# Altium schematic sheet SensWear_DaughterBoard.SchDoc
size A4; SheetNumber: 8; SheetTotal: 8
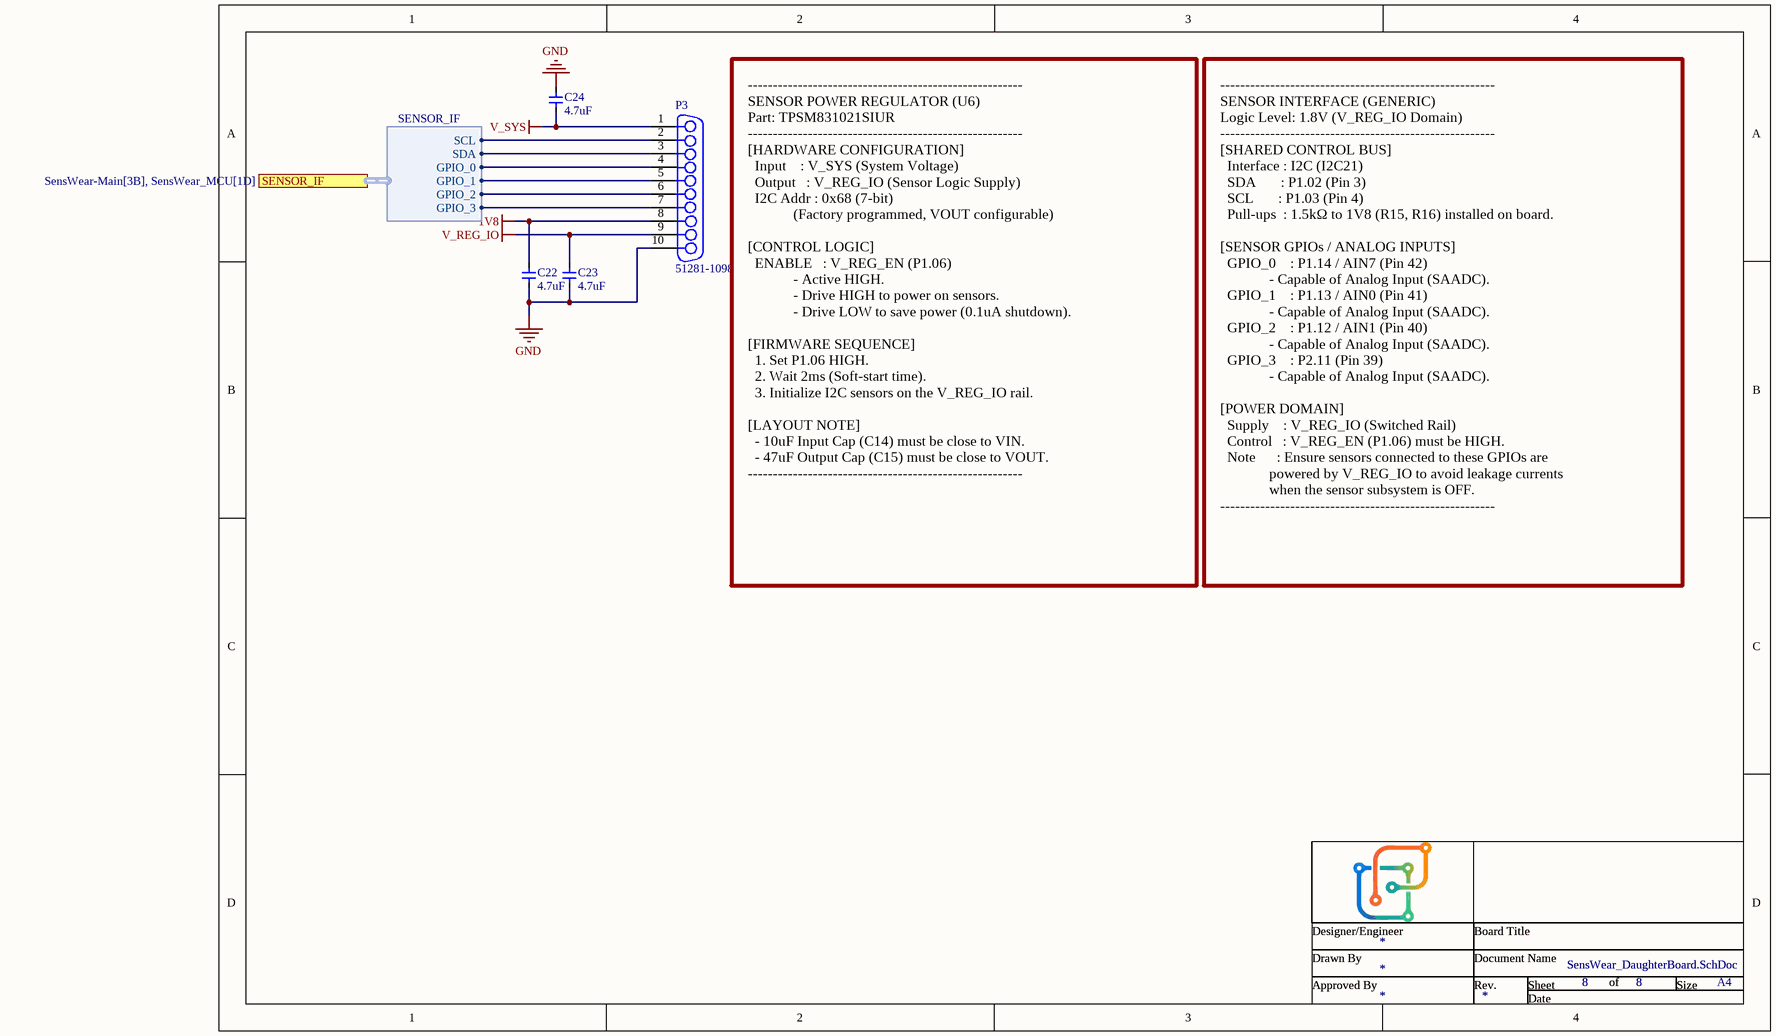
[diagram p0: SensWear_DaughterBoard.SchDoc]

## Parts
C22  4.7uF  [CAPC1005X05N]
C23  4.7uF  [CAPC1005X05N]
C24  4.7uF  [CAPC1005X05N]
P3  51281-1098  [51281-1098__3]

## Ports
SENSOR_IF (harness SENSOR_IF, see SensWear-Main[3B], SensWear_MCU[1D])

## Harnesses
SENSOR_IF: SCL, SDA, GPIO_0, GPIO_1, GPIO_2, GPIO_3

## Nets
1V8: C22.2 P3.8
GND: C22.1 C23.1 C24.2 P3.10
V_REG_IO: C23.2 P3.9
V_SYS: C24.1 P3.1
NetP3_2: P3.2 ; port SENSOR_IF.SCL
NetP3_3: P3.3 ; port SENSOR_IF.SDA
NetP3_4: P3.4 ; port SENSOR_IF.GPIO_0
NetP3_5: P3.5 ; port SENSOR_IF.GPIO_1
NetP3_6: P3.6 ; port SENSOR_IF.GPIO_2
NetP3_7: P3.7 ; port SENSOR_IF.GPIO_3

## Notes on the sheet
- -------------------------------------------------------
  SENSOR POWER REGULATOR (U6)
  Part: TPSM831021SIUR
  -------------------------------------------------------
  [HARDWARE CONFIGURATION]
  Input    : V_SYS (System Voltage)
  Output   : V_REG_IO (Sensor Logic Supply)
  I2C Addr : 0x68 (7-bit)
  (Factory programmed, VOUT configurable)
  [CONTROL LOGIC]
  ENABLE   : V_REG_EN (P1.06)
  - Active HIGH.
  - Drive HIGH to power on sensors.
  - Drive LOW to save power (0.1uA shutdown).
  [FIRMWARE SEQUENCE]
  1. Set P1.06 HIGH.
  2. Wait 2ms (Soft-start time).
  3. Initialize I2C sensors on the V_REG_IO rail.
  [LAYOUT NOTE]
  - 10uF Input Cap (C14) must be close to VIN.
  - 47uF Output Cap (C15) must be close to VOUT.
  -------------------------------------------------------
- -------------------------------------------------------
  SENSOR INTERFACE (GENERIC)
  Logic Level: 1.8V (V_REG_IO Domain)
  -------------------------------------------------------
  [SHARED CONTROL BUS]
  Interface : I2C (I2C21)
  SDA       : P1.02 (Pin 3)
  SCL       : P1.03 (Pin 4)
  Pull-ups  : 1.5kΩ to 1V8 (R15, R16) installed on board.
  [SENSOR GPIOs / ANALOG INPUTS]
  GPIO_0    : P1.14 / AIN7 (Pin 42)
  - Capable of Analog Input (SAADC).
  GPIO_1    : P1.13 / AIN0 (Pin 41)
  - Capable of Analog Input (SAADC).
  GPIO_2    : P1.12 / AIN1 (Pin 40)
  - Capable of Analog Input (SAADC).
  GPIO_3    : P2.11 (Pin 39)
  - Capable of Analog Input (SAADC).
  [POWER DOMAIN]
  Supply    : V_REG_IO (Switched Rail)
  Control   : V_REG_EN (P1.06) must be HIGH.
  Note      : Ensure sensors connected to these GPIOs are
  powered by V_REG_IO to avoid leakage currents
  when the sensor subsystem is OFF.
  -------------------------------------------------------
- Designer/Engineer
- Drawn By
- Document Name
- Board Title
- Sheet
- of
- Size
- A4
- Approved By
- Rev.
- Date

## Library data of the parts
C22-C24 = GRM155R61A475MEAAD: Multilayer Ceramic Capacitor, 4.7 uF, 10 V, ± 20%, X5R, 0402 [1005 Metric]; Manufacturer: Murata; Material: 4241ConductorMaterial; Voltage Rating: 10V; Dielectric: 1537DielectricType; Manufacturer Part Number: GRM155R61A475MEAAD; RoHS: Yes; Category: Ceramic Capacitors; Stock: 930000; Pricing: 10000=0,0187, 50000=0,0159, 100000=0,0132 (USD); Mounting Technology: Surface Mount; Case/Package: 0402; Case Code (Imperial): 0402; Case Code (Metric): 1005; Min Operating Temperature: -55°C; Max Operating Temperature: 85°C; Packaging: Tape and Reel; Value: 4.7uF; Tolerance: 20%; Series: GRM; Voltage Rating (DC): 10V; Length: 1mm; Width: 500um; Height: 650um; Thickness: 500um; RoHS Compliant: Yes; ComponentLink1URL: http://www.farnell.com/datasheets/2189109.pdf?src-supplier=Farnell; ComponentLink1Description: http://www.farnell.com/datasheets/2189109.pdf?src-supplier=Farnell; ComponentLink2URL: http://www.farnell.com/datasheets/2189109.pdf?src-supplier=Newark; ComponentLink2Description: http://www.farnell.com/datasheets/2189109.pdf?src-supplier=Newark; ComponentLink3URL: http://www.farnell.com/datasheets/2189109.pdf?src-supplier=Element14; ComponentLink3Description: http://www.farnell.com/datasheets/2189109.pdf?src-supplier=Element14; ComponentLink4URL: http://datasheet.octopart.com/GRM155R61A475MEAAD-Murata-datasheet-68589269.pdf?src-supplier=Distrelec; ComponentLink4Description: http://datasheet.octopart.com/GRM155R61A475MEAAD-Murata-datasheet-68589269.pdf?src-supplier=Distrelec; ComponentLink5URL: http://datasheet.octopart.com/GRM155R61A475MEAAD-Murata-datasheet-68589269.pdf?src-supplier=Farnell; ComponentLink5Description: http://datasheet.octopart.com/GRM155R61A475MEAAD-Murata-datasheet-68589269.pdf?src-supplier=Farnell; ComponentLink6URL: https://search.murata.co.jp/Ceramy/image/img/A01X/G101/ENG/GRM155R61A475MEAA-01.pdf?src-supplier=Digi-Key; ComponentLink6Description: https://search.murata.co.jp/Ceramy/image/img/A01X/G101/ENG/GRM155R61A475MEAA-01.pdf?src-supplier=Digi-Key; ComponentLink7URL: http://datasheet.octopart.com/GRM155R61A475MEAAD-Murata-datasheet-68589269.pdf?src-supplier=Future+Electronics; ComponentLink7Description: http://datasheet.octopart.com/GRM155R61A475MEAAD-Murata-datasheet-68589269.pdf?src-supplier=Future+Electronics; ComponentLink8URL: https://datasheet.octopart.com/GRM155R61A475MEAAD-Murata-datasheet-68589269.pdf?src-supplier=Newark; ComponentLink8Description: https://datasheet.octopart.com/GRM155R61A475MEAAD-Murata-datasheet-68589269.pdf?src-supplier=Newark; ComponentLink9URL: http://datasheet.octopart.com/GRM155R61A475MEAAD-Murata-datasheet-68589269.pdf?src-supplier=Verical; ComponentLink9Description: http://datasheet.octopart.com/GRM155R61A475MEAAD-Murata-datasheet-68589269.pdf?src-supplier=Verical; ComponentLink10URL: https://datasheet.octopart.com/GRM155R61A475MEAAD-Murata-datasheet-165579666.pdf?src-supplier=TME; ComponentLink10Description: https://datasheet.octopart.com/GRM155R61A475MEAAD-Murata-datasheet-165579666.pdf?src-supplier=TME; ComponentLink11URL: http://datasheet.octopart.com/GRM155R61A475MEAAD-Murata-datasheet-68589269.pdf?src-supplier=Quest; ComponentLink11Description: http://datasheet.octopart.com/GRM155R61A475MEAAD-Murata-datasheet-68589269.pdf?src-supplier=Quest; ComponentLink12URL: http://datasheet.octopart.com/GRM155R61A475MEAAD-Murata-datasheet-68589269.pdf?src-supplier=TTI; ComponentLink12Description: http://datasheet.octopart.com/GRM155R61A475MEAAD-Murata-datasheet-68589269.pdf?src-supplier=TTI; ComponentLink13URL: http://datasheet.octopart.com/GRM155R61A475MEAAD-Murata-datasheet-68589269.pdf?src-supplier=NAC+Semi; ComponentLink13Description: http://datasheet.octopart.com/GRM155R61A475MEAAD-Murata-datasheet-68589269.pdf?src-supplier=NAC+Semi; Supplier 1: Mouser; Supplier Part Number 1: 81-GRM155R61A475MEAD; Supplier 2: Farnell; Supplier Part Number 2: 3581674
P3 = 51281-1098: FFC/FPC Connector, Surface Mount, Right-Angle, Non-ZIF, Dual Contact Style; Manufacturer: Molex; Supplier: Digikey; Supplier Part Number: 900-0512811098CT-ND; Manufacturer Part Number: 51281-1098; RoHS: No; Stock: 2876; Pricing: 1=0.7, 10=0.594, 25=0.5568, 50=0.53, 100=0.5047, 250=0.47304, 500=0.45042, 1000=0.42891 (USD); ComponentLink1URL: https://datasheet.octopart.com/51281-1098-Molex-datasheet-165827616.pdf?src-supplier=Farnell; ComponentLink1Description: https://datasheet.octopart.com/51281-1098-Molex-datasheet-165827616.pdf?src-supplier=Farnell; Supplier 1: Mouser; Supplier Part Number 1: 538-51281-1098; Supplier 2: Digikey; Supplier Part Number 2: 900-0512811098CT-ND; Supplier 3: Digikey; Supplier Part Number 3: 900-0512811098DKR-ND; System: Connector